# EAGLE design laser_diode_driver (EAGLE 7.2.0)
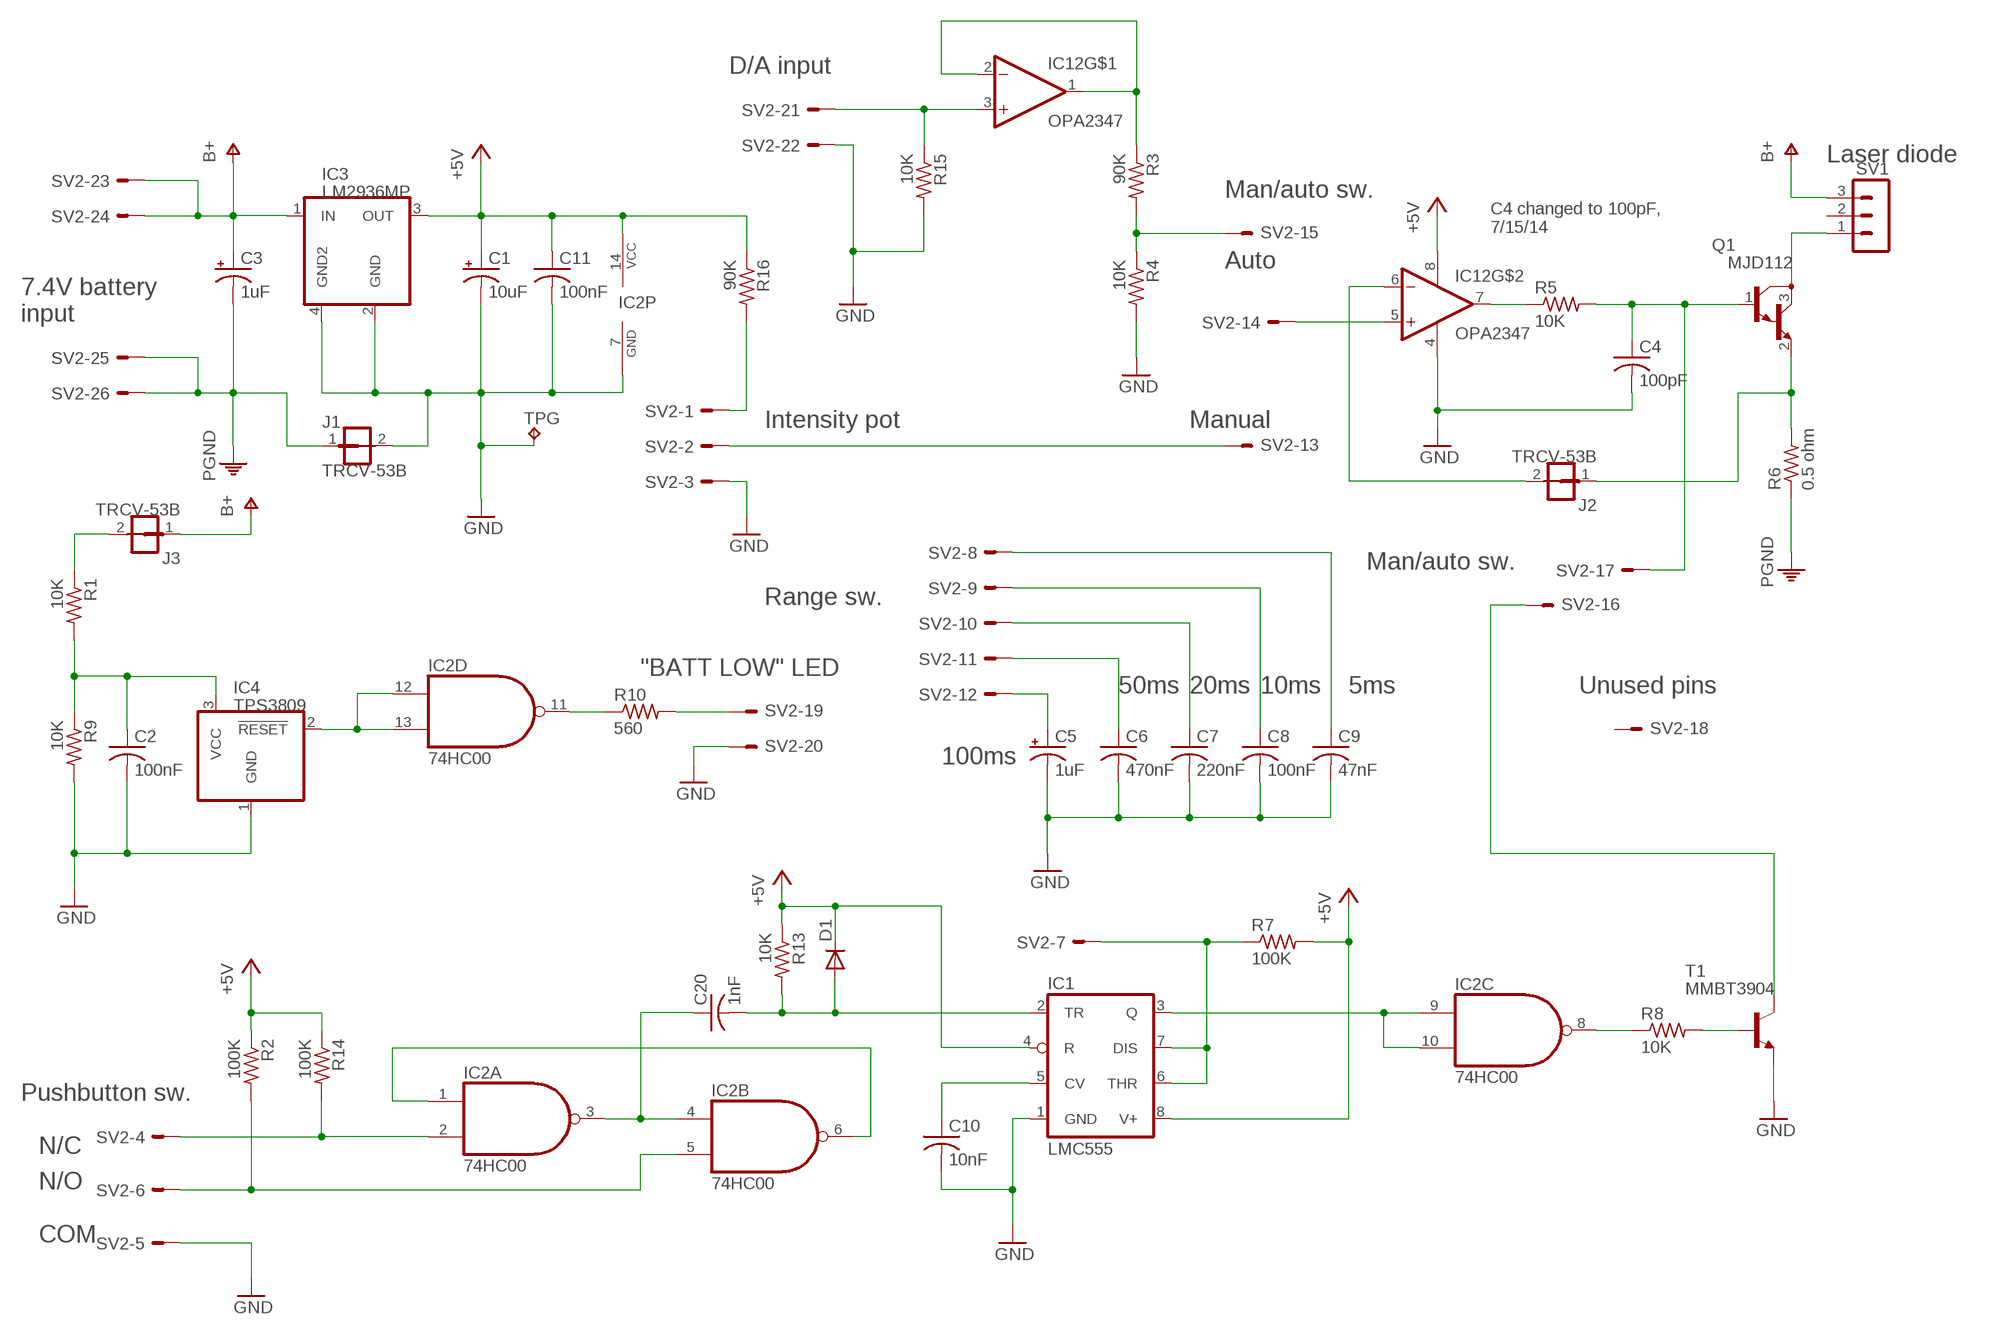
[diagram p0: schematic, sheet 1]

## Parts
C1  10uF  CPOL-USSMCB  [SMC_B]
C2  100nF  C-USC0805  [C0805]
C3  1uF  CPOL-USSMCB  [SMC_B]
C4  100pF  C-USC0805  [C0805]
C5  1uF  CPOL-USSMCB  [SMC_B]
C6  470nF  C-USC0805  [C0805]
C7  220nF  C-USC0805  [C0805]
C8  100nF  C-USC0805  [C0805]
C9  47nF  C-USC0805  [C0805]
C10  10nF  C-USC0805  [C0805]
C11  100nF  C-USC0805  [C0805]
C20  1nF  C-USC0805  [C0805]
D1  DIODE-SOD123  [SOD123]
IC1  LMC555  LM555D  [SO08]
IC2  74HC00  74ALS00D  [SO14]
IC3  LM2936MP  [SOT223]
IC4  TPS3809  [SOT23]
IC12  OPA2347  OPA2227-SO8  [SO08]
J1  TRCV-53B  [JUMPER-TRACE-CONVERT-53-VER2]
J2  TRCV-53B  [JUMPER-TRACE-CONVERT-53-VER2]
J3  TRCV-53B  [JUMPER-TRACE-CONVERT-53-VER2]
Q1  MJD112  [TO252]
R1  10K  R-US_R0805  [R0805]
R2  100K  R-US_R0805  [R0805]
R3  90K  R-US_R0805  [R0805]
R4  10K  R-US_R0805  [R0805]
R5  10K  R-US_R0805  [R0805]
R6  0.5 ohm  R-US_R2512  [R2512]
R7  100K  R-US_R0805  [R0805]
R8  10K  R-US_R0805  [R0805]
R9  10K  R-US_R0805  [R0805]
R10  560  R-US_R0805  [R0805]
R13  10K  R-US_R0805  [R0805]
R14  100K  R-US_R0805  [R0805]
R15  10K  R-US_R0805  [R0805]
R16  90K  R-US_R0805  [R0805]
SV1  MA03-1  [MA03-1]
SV2  ML26LE  [ML26L]
T1  MMBT3904  MMBT3904LT1-NPN-SOT23-BEC  [SOT23-BEC]
TPG  TP-040-100  [P1-040-100]

## Nets
+5V [class-15mil]: C1.+ C11.1 D1.C IC1.4(R) IC1.8(V+) IC2.14(P:VCC) IC3.3(OUT) IC12.8(PWR+) R2.1 R7.2 R13.1 R14.1 R16.1
B+ [class-50mil]: C3.+ IC3.1(IN) J3.1 SV1.3 SV2.23 SV2.24
GND [class-15mil]: C1.- C2.2 C4.2 C5.- C6.2 C7.2 C8.2 C9.2 C10.2 C11.2 IC1.1(GND) IC2.7(P:GND) IC3.2(GND) IC3.4(GND2) IC4.1(GND) IC12.4(PWR-) J1.2 R4.2 R9.2 R15.2 SV2.3 SV2.5 SV2.20 SV2.22 T1.E TPG.P$1(TP)
N$1: C20.1 IC2.3(A:O) IC2.4(B:I0)
N$2: IC12.5(+IN) SV2.14
N$3: IC2.1(A:I0) IC2.6(B:O)
N$4: IC2.2(A:I1) R14.2 SV2.4
N$5: IC2.5(B:I1) R2.2 SV2.6
N$6: C20.2 D1.A IC1.2(TR) R13.2
N$7: C5.+ SV2.12
N$8: IC12.7(OUT) R5.1
N$9: C4.1 Q1.1(B) R5.2 SV2.17
N$10: R16.2 SV2.1
N$11: IC12.3(+IN) R15.1 SV2.21
N$12: IC12.1(OUT) IC12.2(-IN) R3.1
N$13: R3.2 R4.1 SV2.15
N$14: SV2.2 SV2.13
N$15 [class-50mil]: Q1.3(C) SV1.1
N$16: IC12.6(-IN) J2.2
N$17: C6.1 SV2.11
N$18: C7.1 SV2.10
N$19: C8.1 SV2.9
N$20: C9.1 SV2.8
N$21: IC1.6(THR) IC1.7(DIS) R7.1 SV2.7
N$22: C10.1 IC1.5(CV)
N$23: IC1.3(Q) IC2.9(C:I0) IC2.10(C:I1)
N$24: IC2.8(C:O) R8.1
N$25: R8.2 T1.B
N$26: SV2.16 T1.C
N$27: C2.1 IC4.3(VCC) R1.2 R9.1
N$28 [class-50mil]: J2.1 Q1.2(E) R6.2
N$29: IC2.12(D:I0) IC2.13(D:I1) IC4.2(!RESET)
N$30: IC2.11(D:O) R10.1
N$31: R10.2 SV2.19
N$32: J3.2 R1.1
PGND [class-50mil]: C3.- J1.1 R6.1 SV2.25 SV2.26
Unconnected: SV1.2 SV2.18

## Notes on the sheet
- D/A input
- Laser diode
- Man/auto sw.
- C4 changed to 100pF, 
  7/15/14
- Auto
- 7.4V battery
  input
- Intensity pot | Manual
- Man/auto sw.
- Range sw.
- "BATT LOW" LED
- 50ms | 20ms | 10ms | 5ms | Unused pins
- 100ms
- Pushbutton sw.
- N/C
- N/O
- COM

## Library data of the parts
C1 C3 C5 = rcl:CPOL-US: POLARIZED CAPACITOR, American symbol
C2 C4 C6-C11 C20 = rcl:C-US: CAPACITOR, American symbol
D1 = diode:DIODE-: DIODE
IC1 = linear:*555: TIMER
IC2 = 74xx-us:74*00: Quad 2-input NAND gate
IC3 = wng:LM2936MP: Low dropout, low quiescent current positive regulator, SOT-223
IC4 = wng:TPS3809: Supply voltage monitor - simple reset
IC12 = wng:OPA2227-SO8: Dual op amp in SO-8 package
J1-J3 = wng:TRCV-53B: Trace converter for wide line to narrow line.
Q1 = wng:MJD112: NPN Darlington, 2A, 100V, TO-252 DPACK
R1-R10 R13-R16 = rcl:R-US_: RESISTOR, American symbol
SV1 = con-lstb:MA03-1: PIN HEADER; OC_FARNELL: unknown; OC_NEWARK: unknown
SV2 = con-harting-ml:ML26?E: HARTING; OC_FARNELL: unknown; OC_NEWARK: unknown
T1 = transistor:*-NPN-: NPN Transistror BF959 corrected 2008.03.06
TPG = wng:TP-040-100: Testpoint for Keystone 5002K

## Net classes
1 class-15mil: width 0.381 mm
2 class-20mil: width 0.508 mm
4 class-50mil: width 1.27 mm, clearance 0.102 mm

## Board
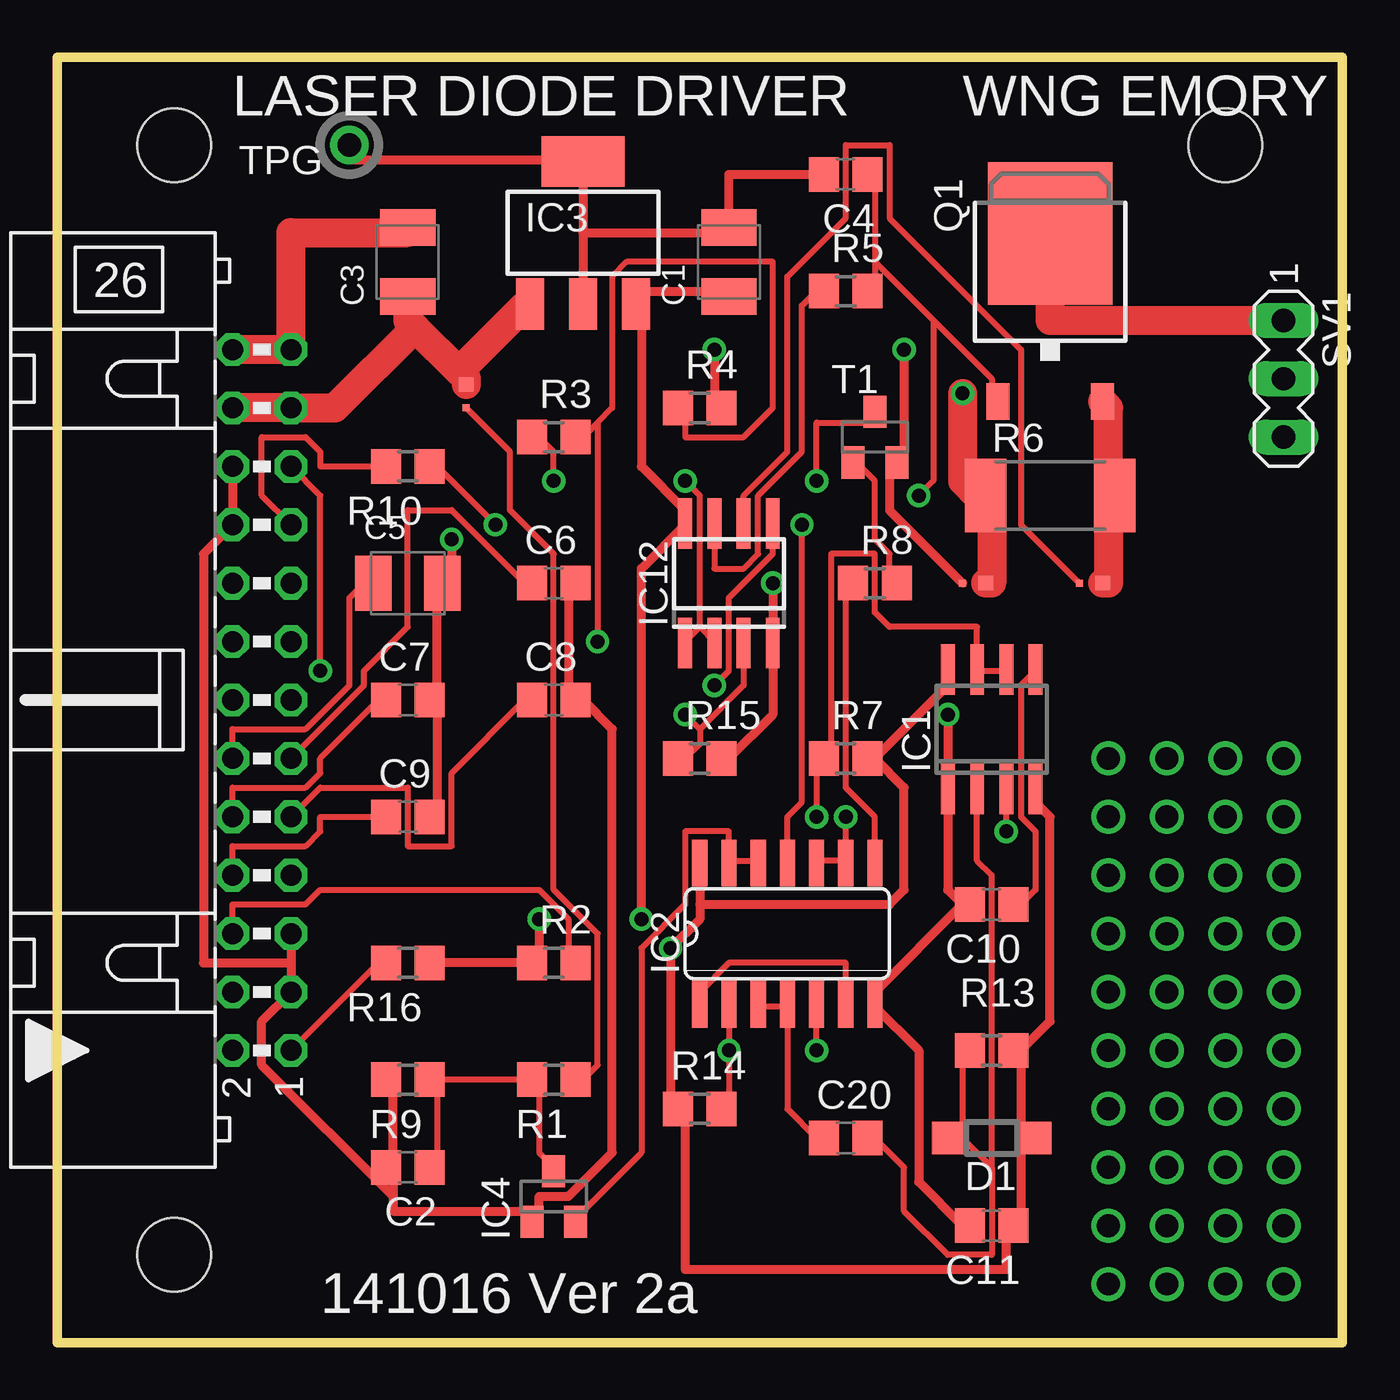
[diagram p1: board, top side]
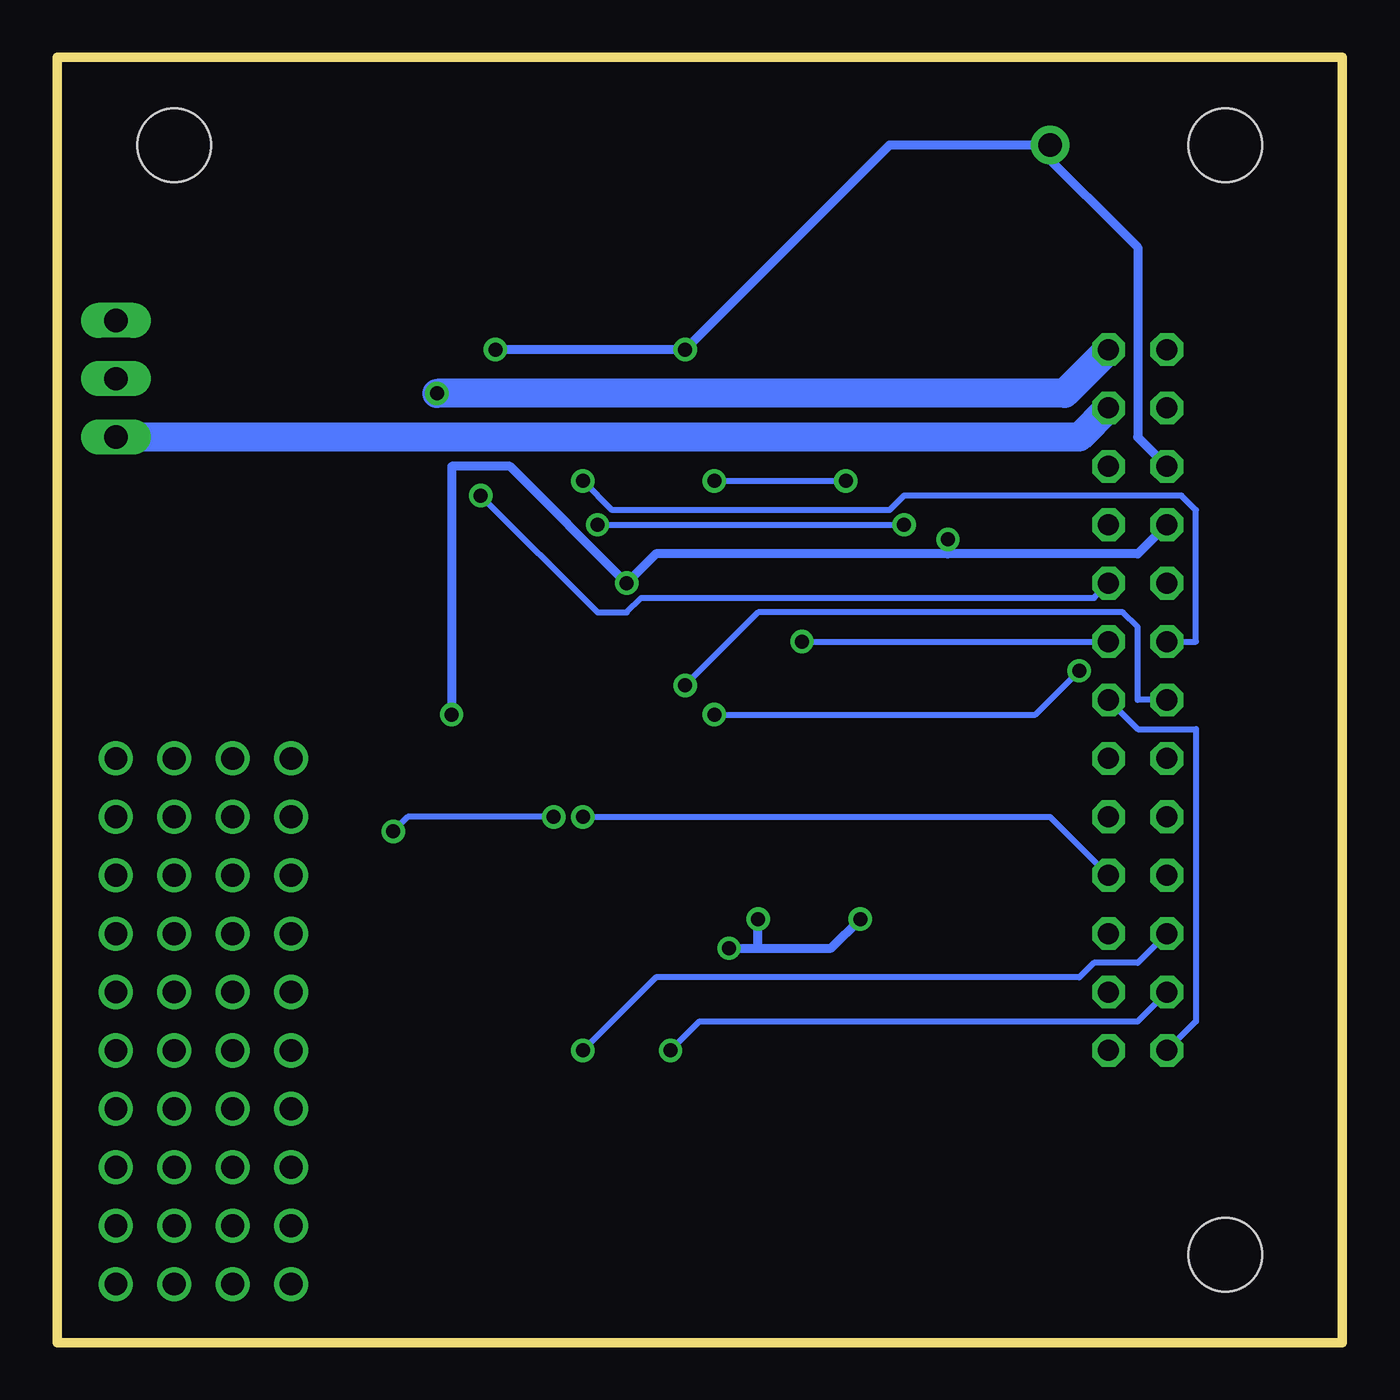
[diagram p2: board, bottom side, seen from below]

Size 55.88 x 55.88 mm. Coordinates in mm from the lower left corner, seen from the top.
Outline: 0,0 0,55.88 55.88,55.88 55.88,0 0,0
Copper layers (1*2*3*16): Top 0.035mm / dielectric 1.5mm / Route2 0.035mm / dielectric 0.15mm / Route3 0.035mm / dielectric 0.2mm / Bottom 0.035mm
Design rules "default *": minimum track width 10mil, minimum drill 24mil, track to track 6mil, track to pad 6mil, pad to pad 6mil, via to via 6mil, smd to smd 6mil, copper to edge 40mil, drill to drill 8mil, minimum pad ring 10mil, minimum via ring 8mil, stop-mask expansion 4mil, vias tented up to drill 0mil, thermal gap 10mil
Holes 3.2 mm at 5.08,52.07 5.08,3.81 50.8,52.07
tRestrict: 16 lines
bRestrict: 16 lines

### Footprints (pad centres in the part's own frame; a part is rotated, then mirrored left to right if it is on the bottom)
SMC_B = smd 1.6 x 2.4: + -1.5,0; - 1.5,0
C0805 = smd 1.3 x 1.5: 1 -0.95,0; 2 0.95,0
SOD123 = smd 1.4 x 1.4: A 1.9,0; C -1.9,0
SO08 = smd 0.6 x 2.2: 1 -1.905,-2.6; 2 -0.635,-2.6; 3 0.635,-2.6; 4 1.905,-2.6; 5 1.905,2.6; 6 0.635,2.6; 7 -0.635,2.6; 8 -1.905,2.6
SO14 = smd 0.66 x 2.032: 1 -3.81,-3.073; 2 -2.54,-3.073; 3 -1.27,-3.073; 4 0,-3.073; 5 1.27,-3.073; 6 2.54,-3.073; 7 3.81,-3.073; 8 3.81,3.073; 9 2.54,3.073; 10 1.27,3.073; 11 0,3.073; 12 -1.27,3.073; 13 -2.54,3.073; 14 -3.81,3.073
SOT223 = smd 1.219 x 2.235: 1 -2.311,-3.099; 2 0,-3.099; 3 2.311,-3.099 | smd 3.6 x 2.2: 4 0,3.099
SOT23 = smd 1 x 1.4: 1 -0.95,-1.1; 2 0.95,-1.1; 3 0,1.1
JUMPER-TRACE-CONVERT-53-VER2 = smd 0.635 x 0.635: 1 -1.016,0 | smd 0.305 x 0.305: 2 0,0
TO252 = smd 1 x 1.6: 1 -3.55,-6.07; 2 1.01,-6.07 | smd 5.4 x 6.2: 3 -1.27,1.23
R0805 = smd 1.3 x 1.5: 1 -0.95,0; 2 0.95,0
R2512 = smd 1.8 x 3.2: 1 -2.8,0; 2 2.8,0
MA03-1 = drill 1.016 long: 1 -2.54,0; 2 0,0; 3 2.54,0
ML26L = drill 0.914 octagon: 1 -15.24,-1.27; 2 -15.24,1.27; 3 -12.7,-1.27; 4 -12.7,1.27; 5 -10.16,-1.27; 6 -10.16,1.27; 7 -7.62,-1.27; 8 -7.62,1.27; 9 -5.08,-1.27; 10 -5.08,1.27; 11 -2.54,-1.27; 12 -2.54,1.27; 13 0,-1.27; 14 0,1.27; 15 2.54,-1.27; 16 2.54,1.27; 17 5.08,-1.27; 18 5.08,1.27; 19 7.62,-1.27; 20 7.62,1.27; 21 10.16,-1.27; 22 10.16,1.27; 23 12.7,-1.27; 24 12.7,1.27; 25 15.24,-1.27; 26 15.24,1.27
SOT23-BEC = smd 1 x 1.4: B -0.95,-1.1; C 0,1.1; E 0.95,-1.1
P1-040-100 = drill 1.016 pad 1.676: P$1 0,0

### Placement (x,y rotation side)
C1  29.21,46.99 90 top
C2  15.24,7.62 180 top
C3  15.24,46.99 90 top
C4  34.29,50.8 180 top
C5  15.24,33.02 0 top
C6  21.59,33.02 0 top
C7  15.24,27.94 0 top
C8  21.59,27.94 0 top
C9  15.24,22.86 0 top
C10  40.64,19.05 180 top
C11  40.64,5.08 180 top
C20  34.29,8.89 0 top
D1  40.64,8.89 180 top
IC1  40.64,26.67 0 top
IC2  31.75,17.78 0 top
IC3  22.86,48.26 0 top
IC4  21.59,6.35 0 top
IC12  29.21,33.02 0 top
J1  39.37,33.02 180 top
J2  44.45,33.02 180 top
J3  17.78,40.64 270 top
Q1  44.45,46.99 0 top
R1  21.59,11.43 180 top
R2  21.59,16.51 0 top
R3  21.59,39.37 0 top
R4  27.94,40.64 0 top
R5  34.29,45.72 0 top
R6  43.18,36.83 0 top
R7  34.29,25.4 0 top
R8  35.56,33.02 0 top
R9  15.24,11.43 180 top
R10  15.24,38.1 180 top
R13  40.64,12.7 180 top
R14  27.94,10.16 0 top
R15  27.94,25.4 0 top
R16  15.24,16.51 180 top
SV1  53.34,41.91 270 top
SV2  8.89,27.94 90 top
T1  35.56,39.37 0 top
TPG  12.7,52.07 0 top

### Tracks (layer width: path | path; a pad name or v marks a point on that pad's centre or on a via)
+5V  (via drill 0.61)
  Top 0.381: 41.91,12.7 41.91,8.89 | 41.91,8.89 41.91,5.08 C11.1 41.28,5.08 41.28,3.18 27.3,3.18 27.3,10.16 R14.1 26.67,10.16 v26.67,17.14 27.94,18.42 27.94,19.05 | 41.91,8.89 D1.C | 41.91,12.7 43.18,13.97 43.18,22.86 42.55,23.5 IC1.4 | 41.91,12.7 R13.1 | C1.+ 29.21,45.72 25.4,45.72 IC3.3 25.4,45.09 25.4,38.1 27.3,36.2 IC12.8 27.3,35.56 25.4,33.66 v25.4,18.42 | 35.56,25.4 38.73,28.57 IC1.8 | R16.1 R2.1 20.95,16.51 v20.95,18.42 | IC2.14 27.94,19.05 | 35.56,25.4 36.83,24.13 36.83,19.69 36.2,19.05 27.94,19.05 | 35.56,25.4 R7.2
  Bottom 0.381: v20.95,18.42 22.22,17.14 25.4,17.14 | v26.67,17.14 25.4,17.14 | 25.4,17.14 v25.4,18.42
B+
  Top 1.27: 15.56,44.13 15.24,44.45 C3.+ | 15.56,44.13 17.46,42.23 | 17.46,42.23 17.78,41.91 J3.1 | 17.46,42.23 20.32,45.09 IC3.1 | SV2.24 SV2.23 12.06,40.64 15.56,44.13
  Bottom 1.27: SV1.3 11.43,39.37 SV2.23
GND  (via drill 0.61)
  Top 0.381: SV2.5 10.16,16.51 | 10.16,16.51 SV2.3 8.89,13.97 8.89,12.06 14.61,6.35 | C6.2 22.22,33.02 22.22,27.94 C8.2 22.86,27.94 24.13,26.67 24.13,8.25 22.22,6.35 20.95,6.35 20.95,5.71 IC4.1 20.32,5.71 14.61,5.71 14.61,6.35 | 14.61,7.62 14.61,6.35 | 14.61,7.62 14.61,11.43 R9.2 | 14.61,7.62 C2.2 | 39.37,19.05 38.73,19.69 IC1.1 38.73,24.13 v38.73,27.3 | C11.2 39.37,5.08 37.47,6.98 37.47,12.7 35.56,14.6 IC2.7 35.56,15.24 39.37,19.05 | 39.37,19.05 C10.2 | C4.2 29.21,50.8 C1.- 29.21,48.26 22.86,48.26 | 22.86,48.26 IC3.4 22.86,51.43 12.7,51.43 TPG.P$1 | 22.86,48.26 IC3.2 | 16.51,27.94 16.51,22.86 C9.2 | 16.51,27.94 16.51,33.02 C5.- 17.14,33.02 v17.14,34.92 | 16.51,27.94 C7.2 | R15.2 29.21,25.4 31.11,27.3 IC12.4 v31.11,33.02 | SV2.22 SV2.20 6.35,34.29 6.35,16.51 10.16,16.51 | J1.2 36.2,36.2 36.2,38.1 T1.E 36.83,38.73 v36.83,43.18 | v28.57,43.18 28.57,40.64 R4.2
  Bottom 0.381: 13.33,52.07 19.68,52.07 v28.57,43.18 v36.83,43.18 | SV2.22 8.89,39.37 8.89,47.62 13.33,52.07 | 13.33,52.07 TPG.P$1 | 17.14,34.29 8.89,34.29 SV2.20 | 17.14,34.29 29.85,34.29 v31.11,33.02 36.2,38.1 38.73,38.1 v38.73,27.3 | 17.14,34.29 v17.14,34.92
N$1
  Top 0.254: 31.75,14.6 31.75,10.16 33.02,8.89 C20.1 | 31.75,14.6 30.48,14.6 IC2.3 | 31.75,14.6 IC2.4
N$2  (via drill 0.61)
  Top 0.254: IC12.5 31.11,34.29 29.21,32.38 29.21,29.21 v28.57,28.57
  Bottom 0.254: v28.57,28.57 25.4,31.75 9.52,31.75 8.89,31.11 8.89,27.94 SV2.14
N$3
  Top 0.254: IC2.6 34.29,16.51 29.21,16.51 27.94,15.24 IC2.1
N$4  (via drill 0.61)
  Top 0.254: IC2.2 v29.21,12.7 29.21,10.16 R14.2
  Bottom 0.254: SV2.4 8.89,13.97 27.94,13.97 v29.21,12.7
N$5  (via drill 0.61)
  Top 0.254: SV2.6 7.62,19.05 10.79,19.05 11.43,19.69 20.95,19.69 22.22,18.42 22.22,16.51 R2.2 | v33.02,12.7 IC2.5
  Bottom 0.254: v33.02,12.7 29.85,15.87 11.43,15.87 10.79,16.51 8.89,16.51 SV2.6
N$6
  Top 0.254: 39.37,8.89 39.37,12.7 R13.2 | 40.64,7.62 40.64,3.81 38.73,3.81 36.83,5.71 36.83,7.62 35.56,8.89 C20.2 | 39.37,8.89 40.64,7.62 | 39.37,8.89 D1.A | IC1.2 40.01,20.96 40.64,20.32 40.64,7.62
N$7
  Top 0.254: SV2.12 7.62,26.67 10.79,26.67 12.7,28.57 12.7,32.38 13.33,33.02 C5.+
N$8
  Top 0.254: IC12.7 28.57,33.66 29.85,33.66 30.48,34.29 30.48,36.83 32.39,38.73 32.39,45.09 33.02,45.72 R5.1
N$9  (via drill 0.61)
  Top 0.254: 35.56,46.99 35.56,50.8 C4.1 | 35.56,46.99 35.56,45.72 R5.2 | 35.56,46.99 38.1,44.45 | 38.1,44.45 40.64,41.91 40.64,41.27 Q1.1 | v37.47,36.83 38.1,37.46 38.1,44.45
  Bottom 0.254: SV2.17 10.79,32.38 30.48,32.38 31.11,31.75 32.39,31.75 v37.47,36.83
N$10
  Top 0.254: SV2.1 13.97,16.51 R16.2
N$11  (via drill 0.61)
  Top 0.254: 27.94,26.67 27.94,26.04 27.3,25.4 R15.1 | 27.94,26.67 29.85,28.57 IC12.3 | SV2.21 11.43,36.83 v11.43,29.21 | 27.94,26.67 v27.3,27.3
  Bottom 0.254: v11.43,29.21 13.33,27.3 v27.3,27.3
N$12  (via drill 0.61)
  Top 0.254: v21.59,37.46 21.59,38.73 20.95,39.37 R3.1 | v27.3,37.46 27.94,36.83 27.94,31.11 | 27.94,31.11 27.3,30.48 IC12.1 | 27.94,31.11 28.57,30.48 IC12.2
  Bottom 0.254: v27.3,37.46 v21.59,37.46
N$13  (via drill 0.61)
  Top 0.254: 23.49,40 24.13,40.64 24.13,46.35 24.76,46.99 31.11,46.99 31.11,40.64 29.85,39.37 27.3,39.37 27.3,40.64 R4.1 | 23.49,40 22.86,39.37 R3.2 | 23.49,40 v23.49,30.48
  Bottom 0.254: v23.49,30.48 SV2.15
N$14
  Bottom 0.254: SV2.2 6.35,13.97 6.35,26.67 8.89,26.67 SV2.13
N$15
  Top 1.27: SV1.1 43.18,44.45 Q1.3
N$16
  Top 0.254: J2.2 41.91,35.56 41.91,43.18 36.2,48.89 36.2,52.07 34.29,52.07 34.29,48.89 31.75,46.35 31.75,38.73 29.85,36.83 IC12.6
N$17
  Top 0.254: SV2.11 13.33,28.57 13.33,29.21 15.24,31.11 15.24,36.2 17.14,36.2 20.32,33.02 C6.1
N$18
  Top 0.254: SV2.10 7.62,24.13 10.79,24.13 11.43,24.77 11.43,25.4 13.97,27.94 C7.1
N$19
  Top 0.254: SV2.9 11.43,24.13 15.24,24.13 15.24,21.59 17.14,21.59 17.14,24.77 20.32,27.94 C8.1
N$20
  Top 0.254: C9.1 11.43,22.86 11.43,22.23 10.79,21.59 7.62,21.59 SV2.8
N$21  (via drill 0.61)
  Top 0.254: IC1.6 41.28,29.21 40.01,29.21 IC1.7 40.01,31.11 36.2,31.11 35.56,31.75 35.56,34.29 33.66,34.29 33.66,25.4 R7.1 33.02,25.4 v33.02,22.86
  Bottom 0.254: SV2.7 12.7,22.86 v33.02,22.86
N$22
  Top 0.254: C10.1 41.91,19.05 42.55,19.69 42.55,22.23 41.91,22.86 41.91,28.57 42.55,29.21 IC1.5
N$23  (via drill 0.61)
  Top 0.254: 34.29,20.96 33.02,20.96 IC2.10 | v41.28,22.23 IC1.3 | 34.29,20.96 v34.29,22.86 | 34.29,20.96 IC2.9
  Bottom 0.254: v41.28,22.23 40.64,22.86 v34.29,22.86
N$24
  Top 0.254: IC2.8 35.56,22.86 34.29,24.13 34.29,33.02 R8.1
N$25
  Top 0.254: T1.B 34.93,38.1 35.56,37.46 35.56,34.92 36.2,34.29 36.2,33.02 R8.2
N$26  (via drill 0.61)
  Top 0.254: v33.02,37.46 33.02,40 35.56,40 T1.C
  Bottom 0.254: v33.02,37.46 31.75,36.2 19.68,36.2 19.05,36.83 6.99,36.83 6.35,36.2 6.35,30.48 SV2.16
N$27
  Top 0.254: 16.51,11.43 16.51,7.62 C2.1 | IC4.3 21.59,7.62 20.95,8.25 20.95,11.43 R1.2 16.51,11.43 | 16.51,11.43 R9.1
N$28
  Top 1.27: 45.72,36.83 45.72,33.02 J2.1 | 45.72,36.83 45.72,40.64 Q1.2 | 45.72,36.83 R6.2
N$29
  Top 0.254: 29.21,20.96 29.21,22.23 27.3,22.23 27.3,19.05 25.4,17.14 25.4,8.25 22.86,5.71 IC4.2 | 29.21,20.96 30.48,20.96 IC2.12 | 29.21,20.96 IC2.13
N$30  (via drill 0.61)
  Top 0.254: v19.05,35.56 16.51,38.1 R10.1 | v32.39,35.56 32.39,23.5 31.75,22.86 IC2.11
  Bottom 0.254: v32.39,35.56 v19.05,35.56
N$31
  Top 0.254: R10.2 11.43,38.1 11.43,38.73 10.79,39.37 8.89,39.37 8.89,36.83 SV2.19
N$32
  Top 0.254: J3.2 19.68,38.73 19.68,36.2 21.59,34.29 21.59,19.69 23.49,17.78 23.49,12.06 22.86,11.43 R1.1
N$33  (via drill 0.99)
  other vias: 53.34,25.4
N$34  (via drill 0.99)
  other vias: 48.26,22.86
N$35  (via drill 0.99)
  other vias: 53.34,20.32
N$36  (via drill 0.99)
  other vias: 48.26,17.78
N$37  (via drill 0.99)
  other vias: 53.34,15.24
N$38  (via drill 0.99)
  other vias: 48.26,12.7
N$39  (via drill 0.99)
  other vias: 53.34,10.16
N$40  (via drill 0.99)
  other vias: 48.26,7.62
N$41  (via drill 0.99)
  other vias: 53.34,5.08
N$42  (via drill 0.99)
  other vias: 48.26,2.54
N$43  (via drill 0.99)
  other vias: 45.72,25.4
N$44  (via drill 0.99)
  other vias: 48.26,25.4
N$45  (via drill 0.99)
  other vias: 50.8,25.4
N$46  (via drill 0.99)
  other vias: 53.34,22.86
N$47  (via drill 0.99)
  other vias: 50.8,22.86
N$48  (via drill 0.99)
  other vias: 45.72,22.86
N$49  (via drill 0.99)
  other vias: 45.72,20.32
N$50  (via drill 0.99)
  other vias: 48.26,20.32
N$51  (via drill 0.99)
  other vias: 50.8,20.32
N$52  (via drill 0.99)
  other vias: 53.34,17.78
N$53  (via drill 0.99)
  other vias: 50.8,17.78
N$54  (via drill 0.99)
  other vias: 45.72,17.78
N$55  (via drill 0.99)
  other vias: 45.72,15.24
N$56  (via drill 0.99)
  other vias: 48.26,15.24
N$57  (via drill 0.99)
  other vias: 50.8,15.24
N$58  (via drill 0.99)
  other vias: 53.34,12.7
N$59  (via drill 0.99)
  other vias: 50.8,12.7
N$60  (via drill 0.99)
  other vias: 45.72,12.7
N$61  (via drill 0.99)
  other vias: 45.72,10.16
N$62  (via drill 0.99)
  other vias: 48.26,10.16
N$63  (via drill 0.99)
  other vias: 50.8,10.16
N$64  (via drill 0.99)
  other vias: 53.34,7.62
N$65  (via drill 0.99)
  other vias: 50.8,7.62
N$66  (via drill 0.99)
  other vias: 45.72,7.62
N$67  (via drill 0.99)
  other vias: 45.72,5.08
N$68  (via drill 0.99)
  other vias: 48.26,5.08
N$69  (via drill 0.99)
  other vias: 50.8,5.08
N$70  (via drill 0.99)
  other vias: 53.34,2.54
N$71  (via drill 0.99)
  other vias: 50.8,2.54
N$72  (via drill 0.99)
  other vias: 45.72,2.54
PGND  (via drill 0.61)
  Top 1.27: J1.1 40.64,33.02 40.64,36.83 R6.1 40.01,36.83 39.37,37.46 v39.37,41.27 | C3.- 15.24,48.26 10.16,48.26 SV2.25 SV2.26
  Bottom 1.27: v39.37,41.27 12.06,41.27 SV2.25

### Text on the board
tPlace: LASER DIODE DRIVER | WNG EMORY | 141016 Ver 2a